# Altium schematic sheet Top Board.SchDoc
size B
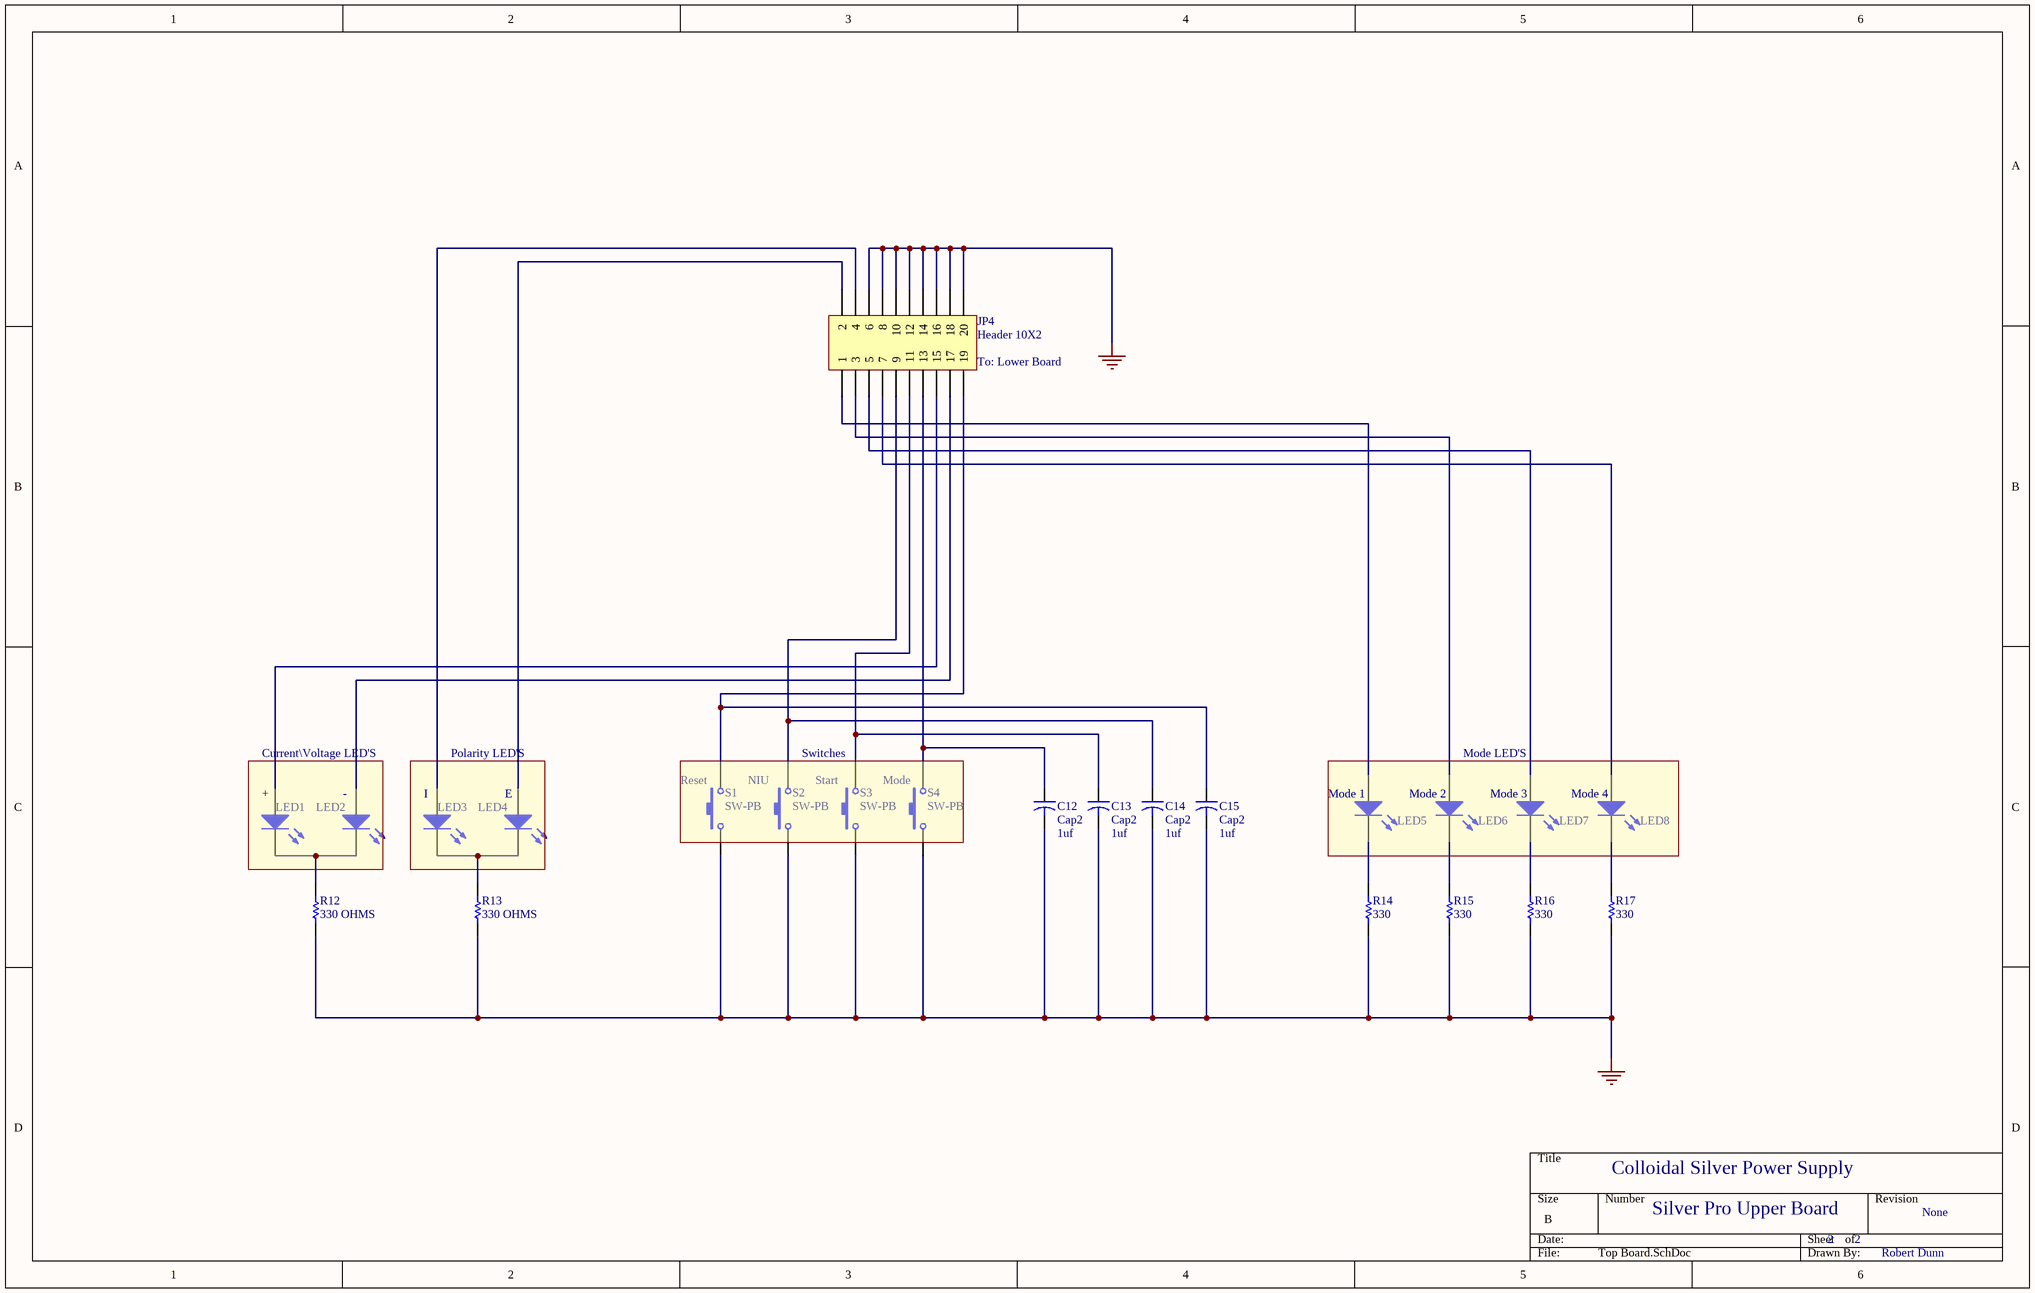
[diagram p0: Top Board.SchDoc]

## Parts
C12  Cap2  value 1uf  [CAPR5-4X5]
C13  Cap2  value 1uf  [CAPR5-4X5]
C14  Cap2  value 1uf  [CAPR5-4X5]
C15  Cap2  value 1uf  [CAPR5-4X5]
DS1  LED1  [LED-1]
DS2  LED2  [LED-1]
DS3  LED3  [LED-1]
DS4  LED4  [LED-1]
DS5  LED5  [LED-1]
DS6  LED6  [LED-1]
DS7  LED7  [LED-1]
DS8  LED8  [LED-1]
JP4  Header 10X2  [HDR2X10]
R12  value 330 OHMS  [AXIAL-0.3]  (hidden comment: Res1)
R13  value 330 OHMS  [AXIAL-0.3]  (hidden comment: Res1)
R14  value 330  [AXIAL-0.3]  (hidden comment: Res1)
R15  value 330  [AXIAL-0.3]  (hidden comment: Res1)
R16  value 330  [AXIAL-0.3]  (hidden comment: Res1)
R17  value 330  [AXIAL-0.3]  (hidden comment: Res1)
S1  SW-PB  [SPST-2]
S2  SW-PB  [SPST-2]
S3  SW-PB  [SPST-2]
S4  SW-PB  [SPST-2]

## Nets
GND: C12.2 C13.2 C14.2 C15.2 JP4.6 JP4.8 JP4.10 JP4.12 JP4.14 JP4.16 JP4.18 JP4.20 R12.1 R13.1 R14.1 R15.1 R16.1 R17.1 S1.1 S2.1 S3.1 S4.1
NetC12_1: C12.1 JP4.13 S4.2
NetC13_1: C13.1 JP4.11 S3.2
NetC14_1: C14.1 JP4.9 S2.2
NetC15_1: C15.1 JP4.19 S1.2
NetDS1_1: DS1.1(A) JP4.15
NetDS1_2: DS1.2(K) DS2.2(K) R12.2
NetDS2_1: DS2.1(A) JP4.17
NetDS3_1: DS3.1(A) JP4.4
NetDS3_2: DS3.2(K) DS4.2(K) R13.2
NetDS4_1: DS4.1(A) JP4.2
NetDS5_1: DS5.1(A) JP4.1
NetDS5_2: DS5.2(K) R14.2
NetDS6_1: DS6.1(A) JP4.3
NetDS6_2: DS6.2(K) R15.2
NetDS7_1: DS7.1(A) JP4.5
NetDS7_2: DS7.2(K) R16.2
NetDS8_1: DS8.1(A) JP4.7
NetDS8_2: DS8.2(K) R17.2

## Notes on the sheet
- (near JP4) To: Lower Board
- Current\Voltage LED'S
- Polarity LED'S
- Switches
- Mode LED'S
- (near DS1) +
- (near DS2) -
- (near DS3) I
- (near DS4) E
- (near S1) Reset
- NIU
- (near S3) Start
- Mode
- (near DS5) Mode 1
- (near DS6) Mode 2
- (near DS7) Mode 3
- (near DS8) Mode 4
- Colloidal Silver Power Supply
- Silver Pro Upper Board
- 2
- None
- Robert Dunn

## Library data of the parts
C12-C15 = Cap2: Capacitor; Published: 23-Sep-2002; Publisher: Altium Limited
DS1-DS8 = LED1: Typical RED GaAs LED; Published: 8-Jun-2000; Revision: July-2002: Re-released for DXP Platform.; Publisher: Altium Limited
JP4 = Header 10X2: Header, 10-Pin, Dual row; Revision: 17-Jul-2002: Re-released for DXP Platform.; Publisher: Altium Limited
R12-R17 = Res1: Resistor; Published: 8-Jun-2000; Revision: July-2002: Re-released for DXP Platform.; Publisher: Altium Limited
S1-S4 = SW-PB: Switch; Published: 24-Mar-1999; Revision: July-2002: Re-released for DXP Platform.; Publisher: Altium Limited